# EAGLE schematic vm_mini_main3a (EAGLE 6.4)

## Sheet 1 of 4
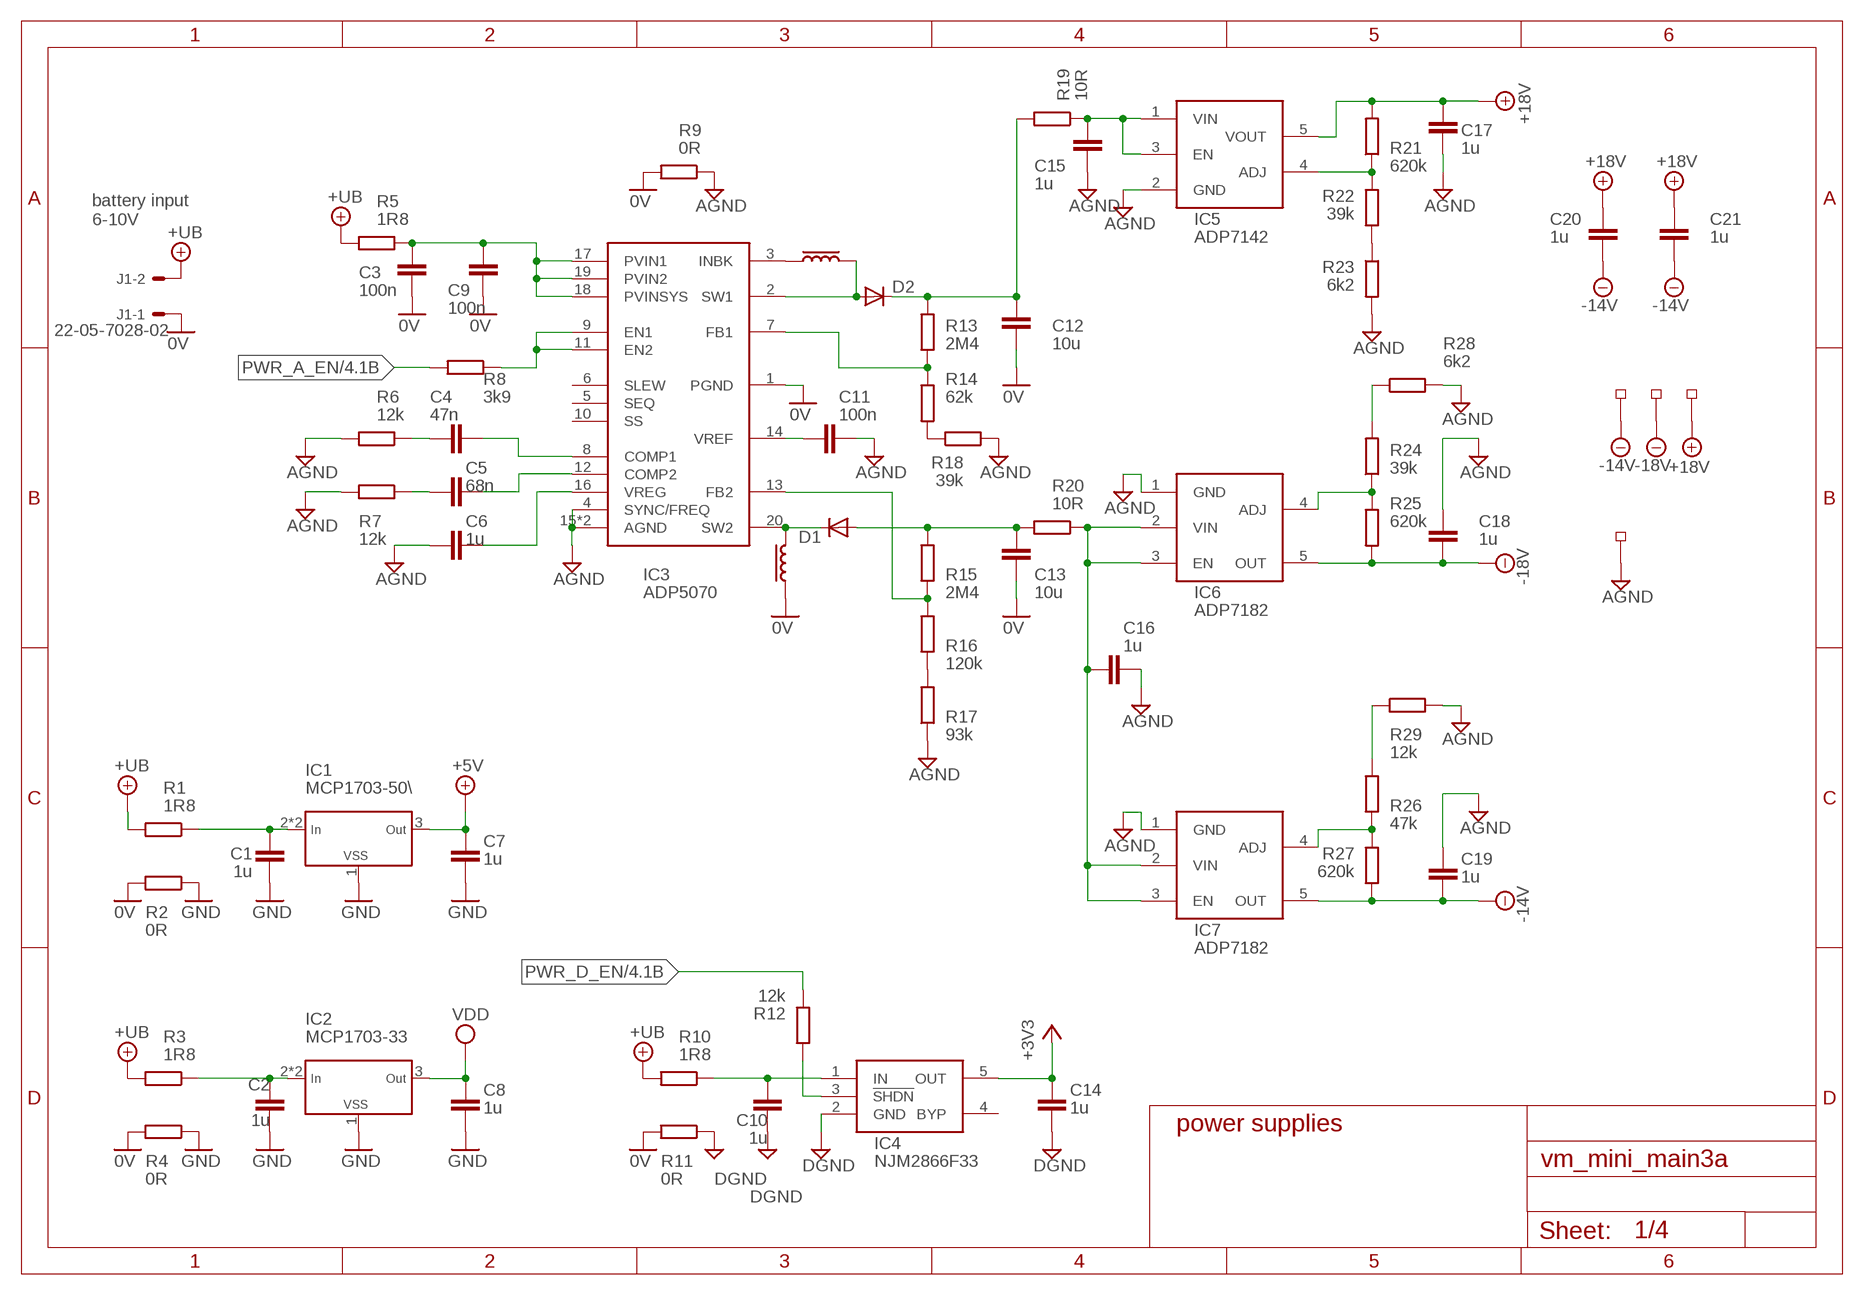
[diagram p0: schematic, sheet 1]

### Parts
C1  1u  C_0806  [R0805]
C2  1u  C_0806  [R0805]
C3  100n  C_0806  [R0805]
C4  47n  C_0806  [R0805]
C5  68n  C_0806  [R0805]
C6  1u  C_0806  [R0805]
C7  1u  C_0806  [R0805]
C8  1u  C_0806  [R0805]
C9  100n  C_0806  [R0805]
C10  1u  C_0806  [R0805]
C11  100n  C_0806  [R0805]
C12  10u  C_0806  [R0805]
C13  10u  C_0806  [R0805]
C14  1u  C_0806  [R0805]
C15  1u  C_0806  [R0805]
C16  1u  C_0806  [R0805]
C17  1u  C_0806  [R0805]
C18  1u  C_0806  [R0805]
C19  1u  C_0806  [R0805]
C20  1u  C_0806  [R0805]
C21  1u  C_0806  [R0805]
D1  DIODE-MINIMELF  [MINIMELF]
D2  DIODE-MINIMELF  [MINIMELF]
IC1  MCP1703-50\  MCP1702-SOT89  [SOT89]
IC2  MCP1703-33  MCP1702-SOT89  [SOT89]
IC3  ADP5070  [TSSOP20-EP]
IC4  NJM2866F33  TC1015  [SOT23-5]
IC5  ADP7142  [SOT23-5L]
IC6  ADP7182  [SOT23-5L]
IC7  ADP7182  [SOT23-5L]
J1  22-05-7028-02  [7395-02]
L1  INDUCTORBOURNS_SRP7030  [BOURNS_SRP7030]
L2  INDUCTORBOURNS_SRP7030  [BOURNS_SRP7030]
R1  1R8  RMMELF  [R_MINIMELF]
R2  0R  RMMELF  [R_MINIMELF]
R3  1R8  RMMELF  [R_MINIMELF]
R4  0R  RMMELF  [R_MINIMELF]
R5  1R8  RMMELF  [R_MINIMELF]
R6  12k  RMMELF  [R_MINIMELF]
R7  12k  RMMELF  [R_MINIMELF]
R8  3k9  RMMELF  [R_MINIMELF]
R9  0R  RMMELF  [R_MINIMELF]
R10  1R8  RMMELF  [R_MINIMELF]
R11  0R  RMMELF  [R_MINIMELF]
R12  12k  RMMELF  [R_MINIMELF]
R13  2M4  RMMELF  [R_MINIMELF]
R14  62k  RMMELF  [R_MINIMELF]
R15  2M4  RMMELF  [R_MINIMELF]
R16  120k  RMMELF  [R_MINIMELF]
R17  93k  RMMELF  [R_MINIMELF]
R18  39k  RMMELF  [R_MINIMELF]
R19  10R  RMMELF  [R_MINIMELF]
R20  10R  RMMELF  [R_MINIMELF]
R21  620k  RMMELF  [R_MINIMELF]
R22  39k  RMMELF  [R_MINIMELF]
R23  6k2  RMMELF  [R_MINIMELF]
R24  39k  RMMELF  [R_MINIMELF]
R25  620k  RMMELF  [R_MINIMELF]
R26  47k  RMMELF  [R_MINIMELF]
R27  620k  RMMELF  [R_MINIMELF]
R28  6k2  RMMELF  [R_MINIMELF]
R29  12k  RMMELF  [R_MINIMELF]
TP1  TEST_PADSMD_35X2  [TP_SMD_35X2]
TP2  TEST_PADSMD_35X2  [TP_SMD_35X2]
TP3  TEST_PADSMD_35X2  [TP_SMD_35X2]
TP4  TEST_PADSMD_35X2  [TP_SMD_35X2]

### Nets
0V: C3.2 C9.2 C12.2 C13.1 IC3.1(PGND) J1.1 L1.P$1 R2.P$2 R4.P$2 R9.P$2 R11.P$2
+3V3: C14.2 IC4.5(OUT) ; also sheet 2,3
+5V: C7.2 IC1.3(OUT) ; also sheet 4
+18V: C17.1 C20.1 C21.1 IC5.5(VOUT) R21.P$2 TP3.P$1 ; also sheet 2,4
+UB: J1.2 R1.P$2 R3.P$2 R5.P$2 R10.P$2 ; also sheet 4
-14V: C19.2 C20.2 C21.2 IC7.5(OUT) R27.P$2 TP1.P$1 ; also sheet 2,4
-18V: C18.2 IC6.5(OUT) R25.P$2 TP2.P$1 ; also sheet 2,4
AGND: C6.1 C11.1 C15.2 C16.2 C17.2 C18.1 C19.1 IC3.4(SYNC/FREQ) IC3.15(AGND) IC3.EP(AGND) IC5.2(GND) IC6.1(GND) IC7.1(GND) R6.P$2 R7.P$2 R9.P$1 R17.P$1 R18.P$2 R23.P$2 R28.P$2 R29.P$2 TP4.P$1 ; also sheet 2,4
DGND: C10.1 C14.1 IC4.2(GND) R11.P$1 ; also sheet 2,3
GND: C1.1 C2.1 C7.1 C8.1 IC1.1(VSS) IC2.1(VSS) R2.P$1 R4.P$1 ; also sheet 4
N$22: IC3.9(EN1) IC3.11(EN2) R8.P$1
N$23: IC4.3(!SHDN) R12.P$2
N$24: R24.P$2 R28.P$1
N$32: C16.1 IC6.2(VIN) IC6.3(EN) IC7.2(VIN) IC7.3(EN) R20.P$1
N$33: C15.1 IC5.1(VIN) IC5.3(EN) R19.P$1
N$48: IC3.3(INBK) L2.P$1
N$49: D1.C IC3.20(SW2) L1.P$2
N$50: D2.A IC3.2(SW1) L2.P$2
N$51: C3.1 C9.1 IC3.17(PVIN1) IC3.18(PVINSYS) IC3.19(PVIN2) R5.P$1
N$52: IC5.4(ADJ) R21.P$1 R22.P$1
N$53: C11.2 IC3.14(VREF)
N$57: C12.1 D2.C R13.P$1 R19.P$2
N$58: C4.1 R6.P$1
N$59: IC3.13(FB2) R15.P$1 R16.P$2
N$60: C5.1 R7.P$1
N$61: IC3.7(FB1) R13.P$2 R14.P$1
N$62: IC6.4(ADJ) R24.P$1 R25.P$1
N$68: C4.2 IC3.8(COMP1)
N$69: C5.2 IC3.12(COMP2)
N$70: C6.2 IC3.16(VREG)
N$71: C13.2 D1.A R15.P$2 R20.P$2
N$72: C10.2 IC4.1(IN) R10.P$1
N$74: C2.2 IC2.2(IN) IC2.2@1(IN) R3.P$1
N$77: C1.2 IC1.2(IN) IC1.2@1(IN) R1.P$1
N$78: IC7.4(ADJ) R26.P$1 R27.P$1
N$86: R22.P$2 R23.P$1
N$95: R26.P$2 R29.P$1
N$117: R16.P$1 R17.P$2
N$118: R14.P$2 R18.P$1
PWR_A_EN: R8.P$2 ; also sheet 4
PWR_D_EN: R12.P$1 ; also sheet 4
VDD: C8.2 IC2.3(OUT) ; also sheet 4
Unconnected: IC3.5(SEQ) IC3.6(SLEW) IC3.10(SS) IC4.4(BYP)

### Notes on the sheet
- battery input
  6-10V
- power supplies

## Sheet 2 of 4
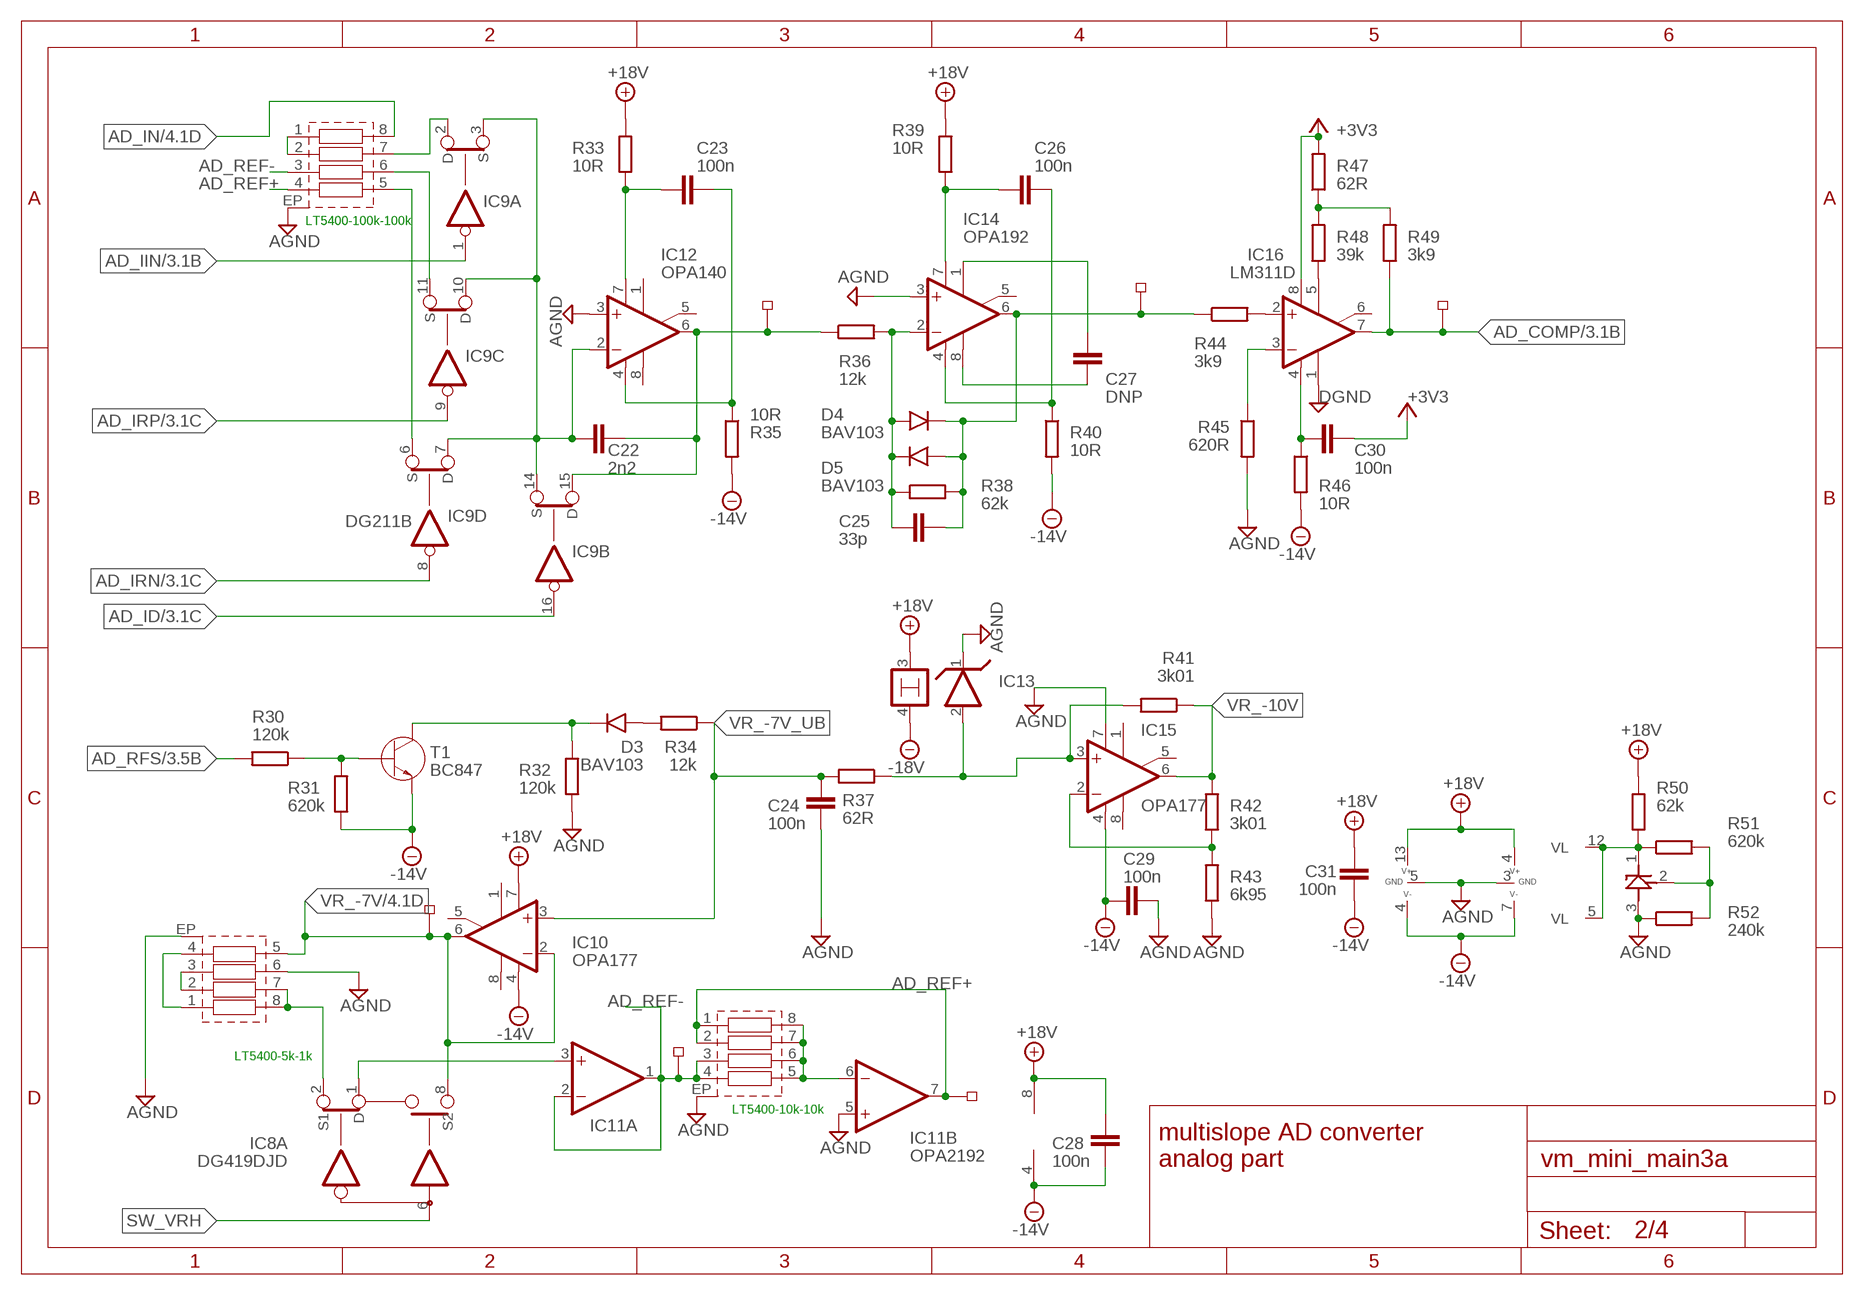
[diagram p1: schematic, sheet 2]

### Parts
C22  2n2  C-EU150-054X183  [C150-054X183]
C23  100n  C_0806  [R0805]
C24  100n  C-EU050-035X075  [C050-035X075]
C25  33p  CMM  [R_MINIMELF]
C26  100n  C_0806  [R0805]
C27  DNP  CMM  [R_MINIMELF]
C28  100n  C_0806  [R0805]
C29  100n  C_0806  [R0805]
C30  100n  C_0806  [R0805]
C31  100n  C_0806  [R0805]
D3  BAV103  1N4148SOD  [SOD-80]
D4  BAV103  1N4148SOD  [SOD-80]
D5  BAV103  1N4148SOD  [SOD-80]
IC8  DG419DJD  [SO08]
IC9  DG211B  DG211CJD  [SO16]
IC10  OPA177  TL071D  [SO08]
IC11  OPA2192  TL072D  [SO08]
IC12  OPA140  TL071D  [SO08]
IC13  LM399H  [TO39/4]
IC14  OPA192  TL071D  [SO08]
IC15  OPA177  TL071D  [SO08]
IC16  LM311D  [SO08]
IC17  TL431_SOT23  [SOT23]
R30  120k  RMMELF  [R_MINIMELF]
R31  620k  RMMELF  [R_MINIMELF]
R32  120k  RMMELF  [R_MINIMELF]
R33  10R  RMMELF  [R_MINIMELF]
R34  12k  RMMELF  [R_MINIMELF]
R35  10R  RMMELF  [R_MINIMELF]
R36  12k  RMMELF  [R_MINIMELF]
R37  62R  RMMELF  [R_MINIMELF]
R38  62k  RMMELF  [R_MINIMELF]
R39  10R  RMMELF  [R_MINIMELF]
R40  10R  RMMELF  [R_MINIMELF]
R41  3k01  R191  [R_TR191]
R42  3k01  R191  [R_TR191]
R43  6k95  R191  [R_TR191]
R44  3k9  RMMELF  [R_MINIMELF]
R45  620R  RMMELF  [R_MINIMELF]
R46  10R  RMMELF  [R_MINIMELF]
R47  62R  RMMELF  [R_MINIMELF]
R48  39k  RMMELF  [R_MINIMELF]
R49  3k9  RMMELF  [R_MINIMELF]
R50  62k  RMMELF  [R_MINIMELF]
R51  620k  RMMELF  [R_MINIMELF]
R52  240k  RMMELF  [R_MINIMELF]
RN1  LT5400-5k-1k  LT5400  [MSOP8-EP]
RN2  LT5400-100k-100k  LT5400  [MSOP8-EP]
RN3  LT5400-10k+10k  LT5400  [MSOP8-EP]
T1  BC847  [SOT23]
TP5  TEST_PADSMD_35X2  [TP_SMD_35X2]
TP6  TEST_PADSMD_35X2  [TP_SMD_35X2]
TP7  TEST_PADSMD_35X2  [TP_SMD_35X2]
TP8  TEST_PADSMD_35X2  [TP_SMD_35X2]
TP9  TEST_PADSMD_35X2  [TP_SMD_35X2]
TP21  TEST_PADSMD_35X2  [TP_SMD_35X2]

### Nets
+3V3: C30.1 IC16.8(V+) R47.P$2 ; also sheet 1,3
+18V: C28.2 C31.2 IC8.4(P:V+) IC9.13(P:V+) IC10.7(V+) IC11.8(P:V+) IC13.3 R33.P$2 R39.P$2 R50.P$1 ; also sheet 1,4
-14V: C28.1 C29.1 C31.1 IC8.7(P:V-) IC9.4(P:V-) IC10.4(V-) IC11.4(P:V-) IC15.4(V-) R31.P$1 R35.P$2 R40.P$2 R46.P$2 T1.2(E) ; also sheet 1,4
-18V: IC13.4 ; also sheet 1,4
AD_COMP: IC16.7(OUT) R49.P$1 TP7.P$1 ; also sheet 3
AD_ID: IC9.16(B:IN) ; also sheet 3
AD_IIN: IC9.1(A:IN) ; also sheet 3
AD_IN: RN2.8(R1B) ; also sheet 4
AD_IRN: IC9.8(D:IN) ; also sheet 3
AD_IRP: IC9.9(C:IN) ; also sheet 3
AD_REF+: IC11.7(B:OUT) RN2.4(R4A) RN3.1(R1A) RN3.2(R2A) TP8.P$1
AD_REF-: IC11.1(A:OUT) IC11.2(A:-IN) RN2.3(R3A) RN3.3(R3A) RN3.4(R4A) TP9.P$1
AD_RFS: R30.P$2 ; also sheet 3
AGND: C24.2 C29.2 IC8.3(P:GND) IC9.5(P:GND) IC11.5(B:+IN) IC12.3(+IN) IC13.1 IC14.3(+IN) IC15.7(V+) IC17.3(A) R32.P$2 R43.P$1 R45.P$2 R52.P$1 RN1.6(R3B) RN1.EP(SH) RN2.EP(SH) RN3.EP(SH) ; also sheet 1,4
DGND: IC16.1(GND) ; also sheet 1,3
N$15: C22.1 IC9.3(A:S) IC9.7(D:D) IC9.10(C:D) IC9.14(B:S) IC12.2(-IN)
N$17: IC15.2(-IN) R42.P$2 R43.P$2
N$18: IC9.2(A:D) RN2.7(R2B)
N$19: C22.2 IC9.15(B:D) IC12.6(OUT) R36.P$1 TP5.P$1
N$25: IC9.11(C:S) RN2.6(R3B)
N$26: IC9.6(D:S) RN2.5(R4B)
N$27: C23.2 IC12.7(V+) R33.P$1
N$28: C23.1 IC12.4(V-) R35.P$1
N$29: IC8.1(A:D) IC11.3(A:+IN)
N$30: RN1.1(R1A) RN1.4(R4A)
N$38: D3.A R34.P$2
N$45: IC8.2(A:S1) RN1.7(R2B) RN1.8(R1B)
N$54: IC13.2 IC15.3(+IN) R37.P$1 R41.P$2
N$56: C25.P$1 D4.A D5.K IC14.2(-IN) R36.P$2 R38.P$1
N$63: R30.P$1 R31.P$2 T1.1(B)
N$64: D3.K R32.P$1 T1.3(C)
N$65: RN2.1(R1A) RN2.2(R2A)
N$66: IC11.6(B:-IN) RN3.5(R4B) RN3.6(R3B) RN3.7(R2B) RN3.8(R1B)
N$67: RN1.2(R2A) RN1.3(R3A)
N$79: C26.2 IC14.7(V+) R39.P$1
N$80: C26.1 IC14.4(V-) R40.P$1
N$81: C25.P$2 D4.K D5.A IC14.6(OUT) R38.P$2 R44.P$1 TP6.P$1
N$84: IC16.5(ON) R48.P$1
N$85: R47.P$1 R48.P$2 R49.P$2
N$87: C30.2 IC16.4(V-) R46.P$1
N$88: IC16.2(+IN) R44.P$2
N$89: IC16.3(-IN) R45.P$1
N$90: IC17.2(R) R51.P$2 R52.P$2
N$91: IC8.5(VL:VL) IC9.12(VL:VL) IC17.1(C) R50.P$2 R51.P$1
N$115: C27.P$1 IC14.8(OPT)
N$116: C27.P$2 IC14.1(ON1)
SW_VRH: IC8.6(A:IN)
VR_-7V: IC8.8(A:S2) IC10.2(-IN) IC10.6(OUT) RN1.5(R4B) TP21.P$1 ; also sheet 4
VR_-7V_UB: C24.1 IC10.3(+IN) R34.P$1 R37.P$2
VR_-10V: IC15.6(OUT) R41.P$1 R42.P$1
Unconnected: IC10.1(ON1) IC10.5(ON2) IC10.8(OPT) IC12.1(ON1) IC12.5(ON2) IC12.8(OPT) IC14.5(ON2) IC15.1(ON1) IC15.5(ON2) IC15.8(OPT) IC16.6(ON/STR)

### Notes on the sheet
- LT5400-100k-100k
- LT5400-5k-1k
- LT5400-10k-10k
- multislope AD converter
  analog part

## Sheet 3 of 4
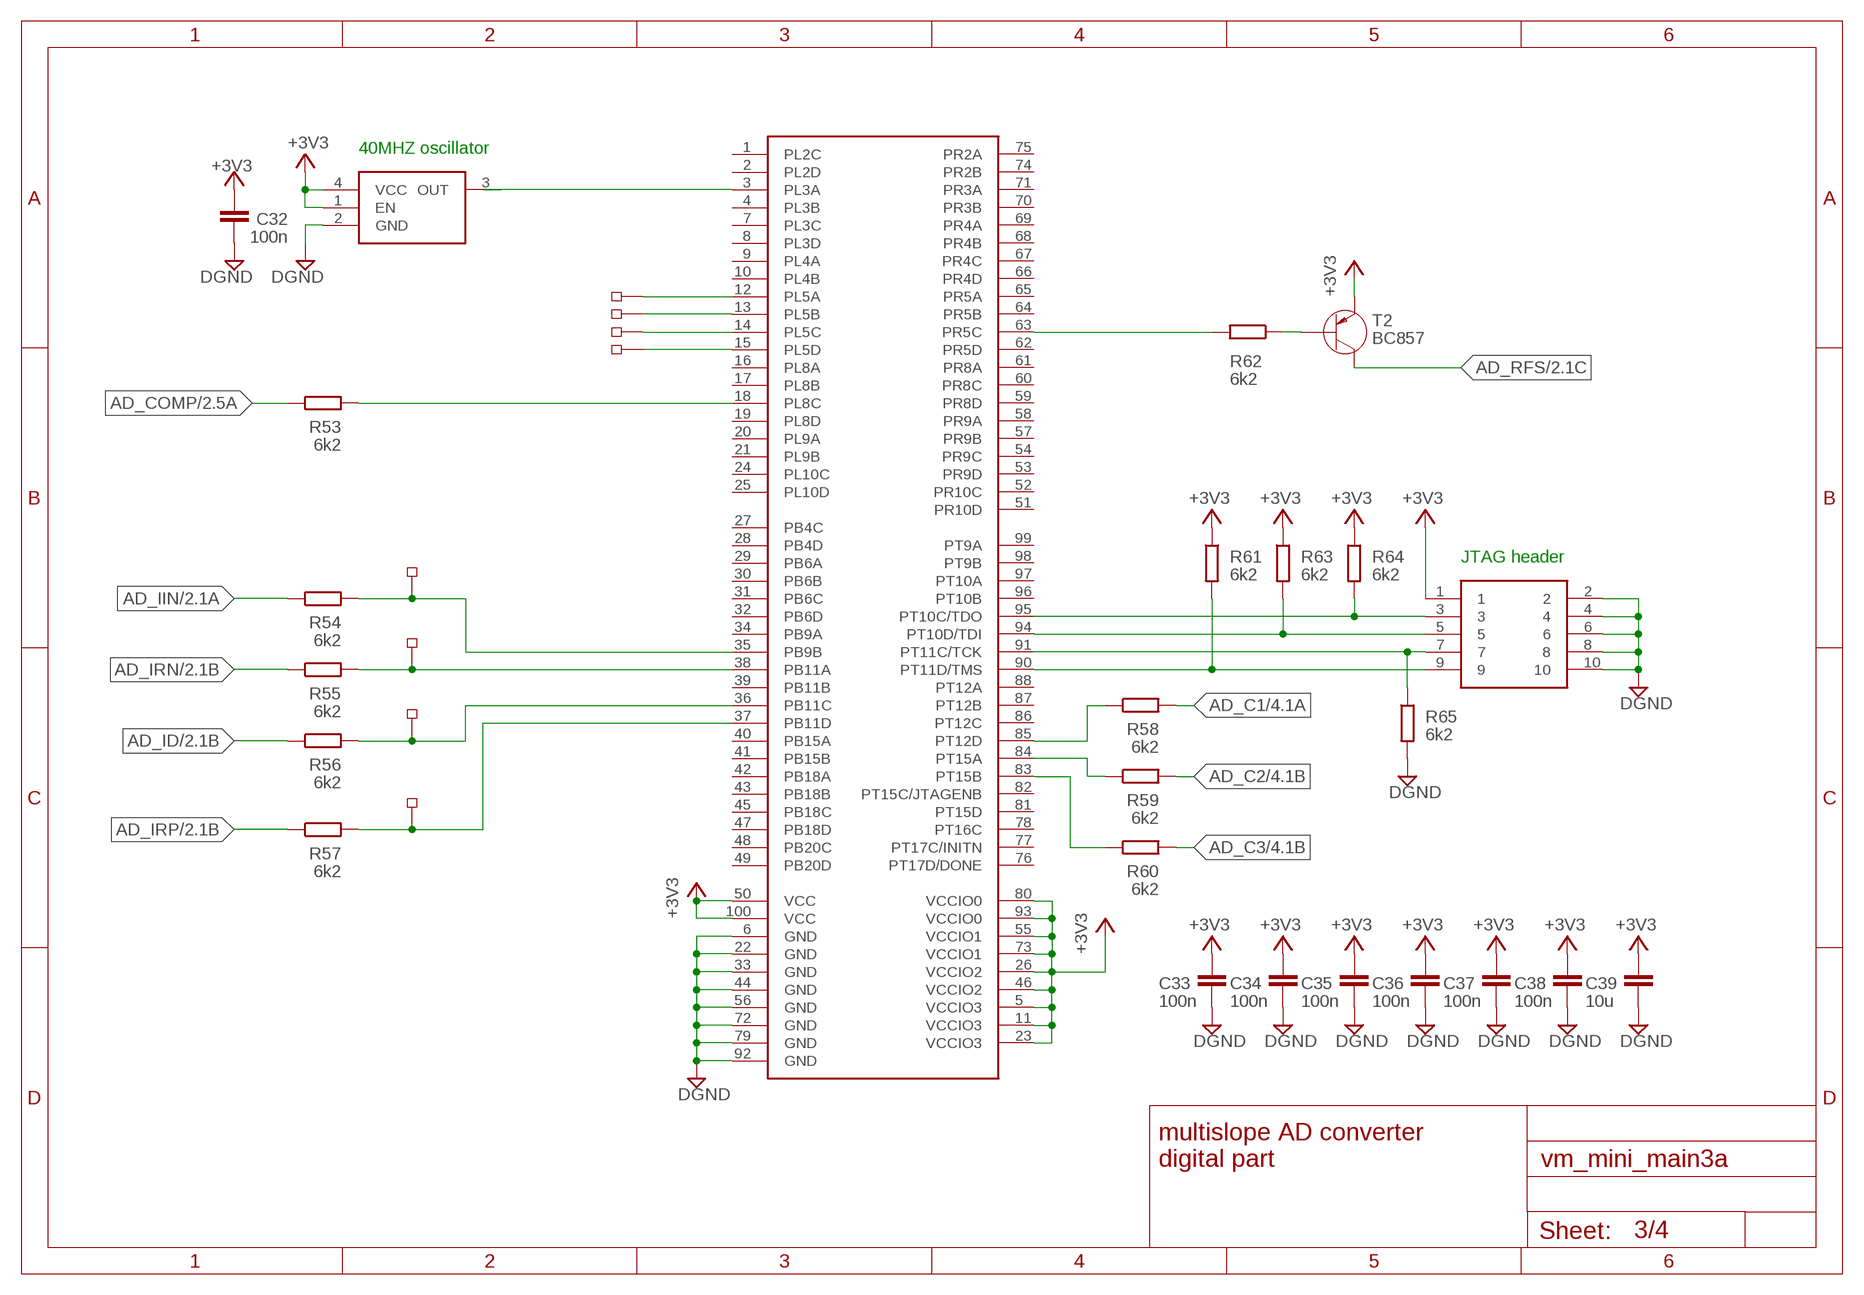
[diagram p2: schematic, sheet 3]

### Parts
C32  100n  C_0806  [R0805]
C33  100n  C_0806  [R0805]
C34  100n  C_0806  [R0805]
C35  100n  C_0806  [R0805]
C36  100n  C_0806  [R0805]
C37  100n  C_0806  [R0805]
C38  100n  C_0806  [R0805]
C39  10u  C_0806  [R0805]
CON1  IDC_10_2MM  [IDC_20_10P]
IC18  MACHXO2-1200-TQ100T100  [TQFP100]
OSC1  OSC3225  [OSC_3225]
R53  6k2  RMMELF  [R_MINIMELF]
R54  6k2  RMMELF  [R_MINIMELF]
R55  6k2  RMMELF  [R_MINIMELF]
R56  6k2  RMMELF  [R_MINIMELF]
R57  6k2  RMMELF  [R_MINIMELF]
R58  6k2  RMMELF  [R_MINIMELF]
R59  6k2  RMMELF  [R_MINIMELF]
R60  6k2  RMMELF  [R_MINIMELF]
R61  6k2  RMMELF  [R_MINIMELF]
R62  6k2  RMMELF  [R_MINIMELF]
R63  6k2  RMMELF  [R_MINIMELF]
R64  6k2  RMMELF  [R_MINIMELF]
R65  6k2  RMMELF  [R_MINIMELF]
T2  BC857  [SOT23]
TP10  TEST_PADSMD_35X2  [TP_SMD_35X2]
TP11  TEST_PADSMD_35X2  [TP_SMD_35X2]
TP12  TEST_PADSMD_35X2  [TP_SMD_35X2]
TP13  TEST_PADSMD_35X2  [TP_SMD_35X2]
TP14  TEST_PADSMD_35X2  [TP_SMD_35X2]
TP15  TEST_PADSMD_35X2  [TP_SMD_35X2]
TP16  TEST_PADSMD_35X2  [TP_SMD_35X2]
TP17  TEST_PADSMD_35X2  [TP_SMD_35X2]

### Nets
+3V3: C32.2 C33.2 C34.2 C35.2 C36.2 C37.2 C38.2 C39.2 CON1.1 IC18.5(VCCIO3) IC18.11(VCCIO3) IC18.23(VCCIO3) IC18.26(VCCIO2) IC18.46(VCCIO2) IC18.50(VCC) IC18.55(VCCIO1) IC18.73(VCCIO1) IC18.80(VCCIO0) IC18.93(VCCIO0) IC18.100(VCC) OSC1.1(EN) OSC1.4(VCC) R61.P$1 R63.P$1 R64.P$1 T2.2(C) ; also sheet 1,2
AD_C1: R58.P$2 ; also sheet 4
AD_C2: R59.P$2 ; also sheet 4
AD_C3: R60.P$2 ; also sheet 4
AD_COMP: R53.P$1 ; also sheet 2
AD_ID: R56.P$1 ; also sheet 2
AD_IIN: R54.P$1 ; also sheet 2
AD_IRN: R55.P$1 ; also sheet 2
AD_IRP: R57.P$1 ; also sheet 2
AD_RFS: T2.3(E) ; also sheet 2
DGND: C32.1 C33.1 C34.1 C35.1 C36.1 C37.1 C38.1 C39.1 CON1.2 CON1.4 CON1.6 CON1.8 CON1.10 IC18.6(GND) IC18.22(GND) IC18.33(GND) IC18.44(GND) IC18.56(GND) IC18.72(GND) IC18.79(GND) IC18.92(GND) OSC1.2(GND) R65.P$2 ; also sheet 1,2
N$16: IC18.3(PL3A) OSC1.3(OUT)
N$37: R62.P$1 T2.1(B)
N$42: IC18.35(PB9B) R54.P$2 TP10.P$1
N$43: CON1.9 IC18.90(PT11D/TMS) R61.P$2
N$44: CON1.7 IC18.91(PT11C/TCK) R65.P$1
N$46: CON1.5 IC18.94(PT10D/TDI) R63.P$2
N$47: CON1.3 IC18.95(PT10C/TDO) R64.P$2
N$55: IC18.84(PT15A) R59.P$1
N$73: IC18.36(PB11C) R56.P$2 TP13.P$1
N$75: IC18.83(PT15B) R60.P$1
N$76: IC18.37(PB11D) R57.P$2 TP11.P$1
N$82: IC18.38(PB11A) R55.P$2 TP12.P$1
N$83: IC18.18(PL8C) R53.P$2
N$92: IC18.63(PR5C) R62.P$2
N$96: IC18.85(PT12D) R58.P$1
N$103: IC18.12(PL5A) TP14.P$1
N$104: IC18.13(PL5B) TP15.P$1
N$105: IC18.14(PL5C) TP16.P$1
N$106: IC18.15(PL5D) TP17.P$1
Unconnected: IC18.1(PL2C) IC18.2(PL2D) IC18.4(PL3B) IC18.7(PL3C) IC18.8(PL3D) IC18.9(PL4A) IC18.10(PL4B) IC18.16(PL8A) IC18.17(PL8B) IC18.19(PL8D) IC18.20(PL9A) IC18.21(PL9B) IC18.24(PL10C) IC18.25(PL10D) IC18.27(PB4C) IC18.28(PB4D) IC18.29(PB6A) IC18.30(PB6B) IC18.31(PB6C) IC18.32(PB6D) IC18.34(PB9A) IC18.39(PB11B) IC18.40(PB15A) IC18.41(PB15B) IC18.42(PB18A) IC18.43(PB18B) IC18.45(PB18C) IC18.47(PB18D) IC18.48(PB20C) IC18.49(PB20D) IC18.51(PR10D) IC18.52(PR10C) IC18.53(PR9D) IC18.54(PR9C) IC18.57(PR9B) IC18.58(PR9A) IC18.59(PR8D) IC18.60(PR8C) IC18.61(PR8A) IC18.62(PR5D) IC18.64(PR5B) IC18.65(PR5A) IC18.66(PR4D) IC18.67(PR4C) IC18.68(PR4B) IC18.69(PR4A) IC18.70(PR3B) IC18.71(PR3A) IC18.74(PR2B) IC18.75(PR2A) IC18.76(PT17D/DONE) IC18.77(PT17C/INITN) IC18.78(PT16C) IC18.81(PT15D) IC18.82(PT15C/JTAGENB) IC18.86(PT12C) IC18.87(PT12B) IC18.88(PT12A) IC18.96(PT10B) IC18.97(PT10A) IC18.98(PT9B) IC18.99(PT9A)

### Notes on the sheet
- 40MHZ oscillator
- JTAG header
- multislope AD converter
  digital part

## Sheet 4 of 4
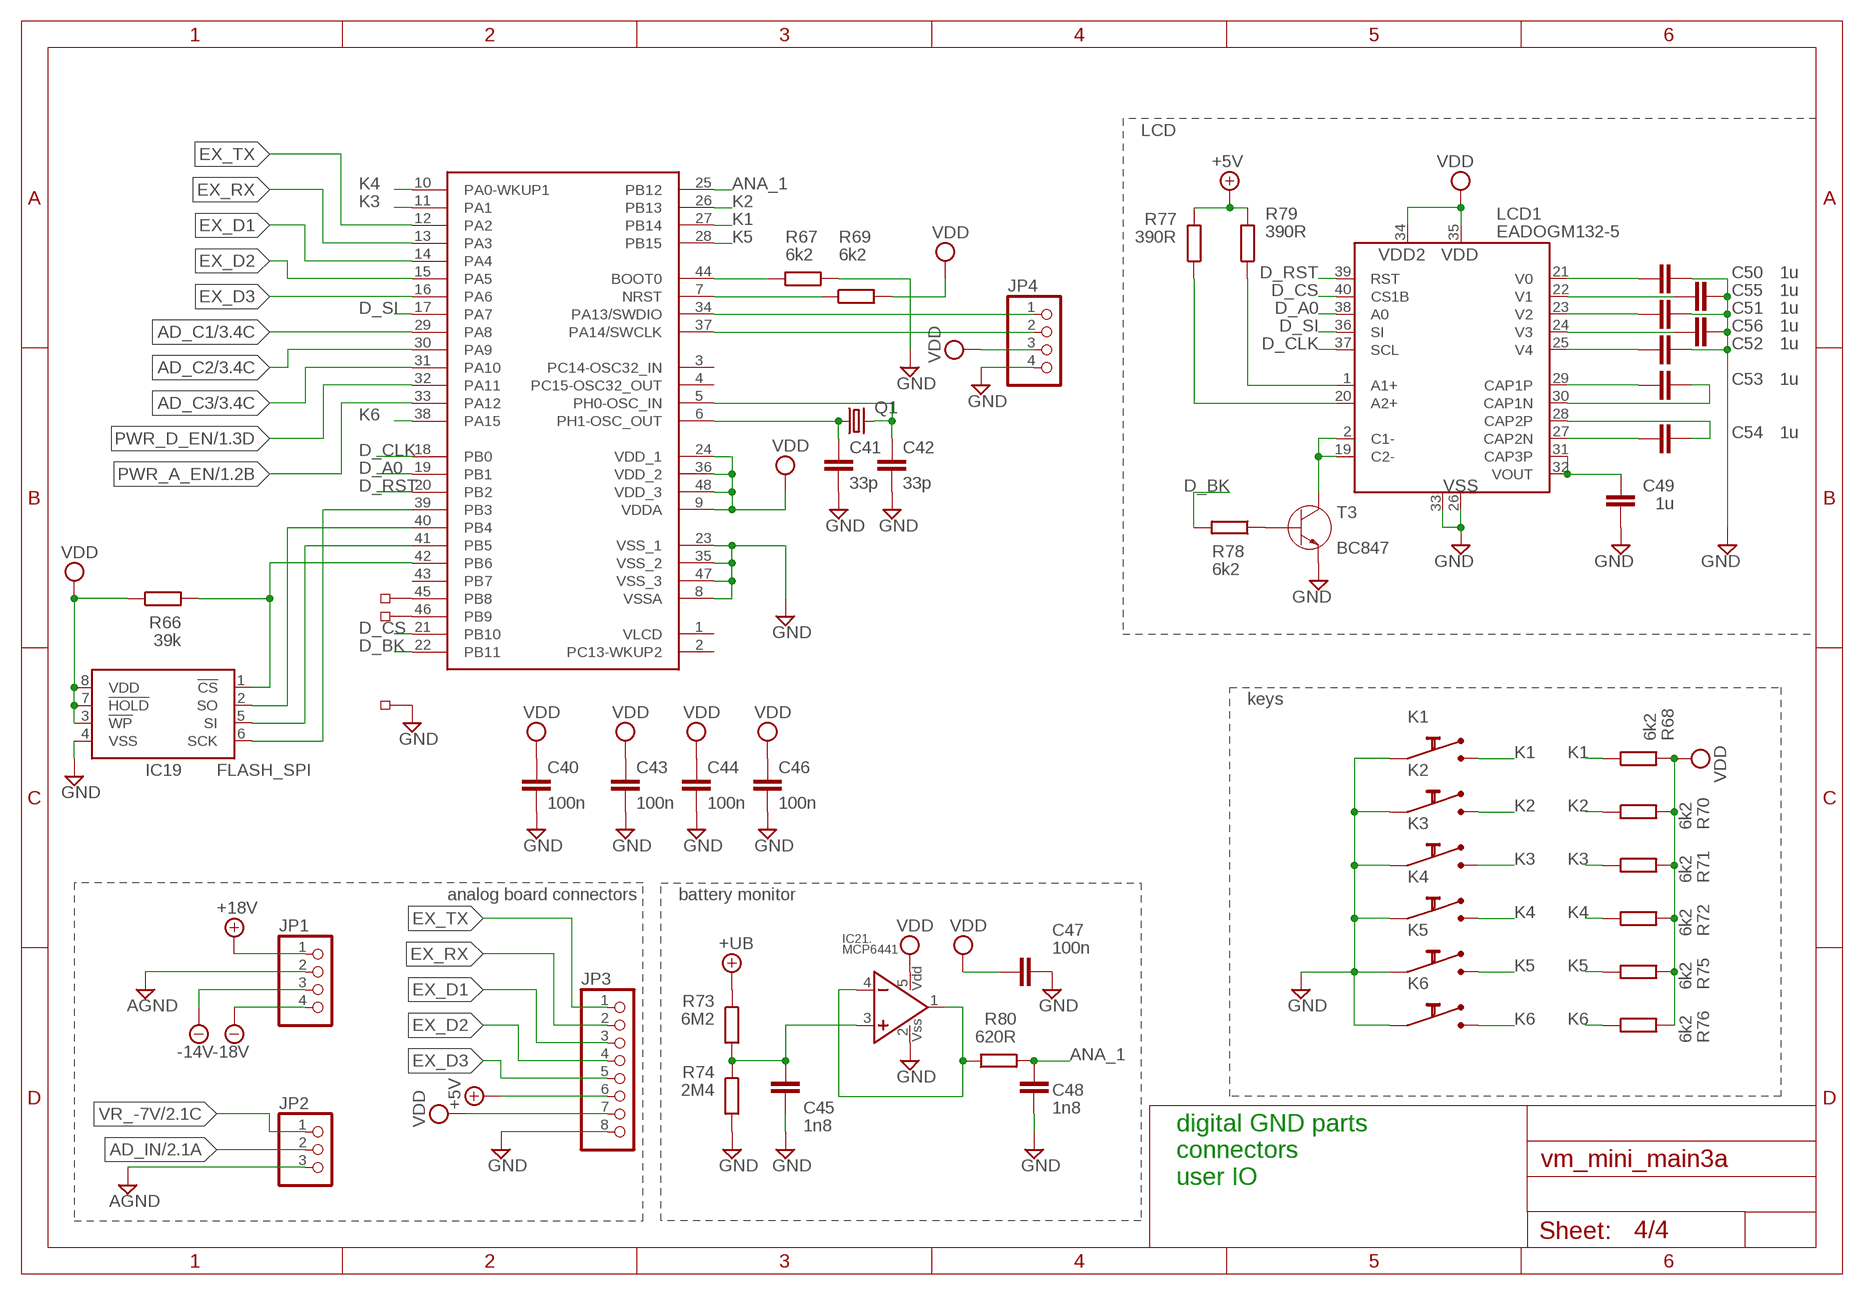
[diagram p3: schematic, sheet 4]

### Parts
C40  100n  C_0806  [R0805]
C41  33p  C_0806  [R0805]
C42  33p  C_0806  [R0805]
C43  100n  C_0806  [R0805]
C44  100n  C_0806  [R0805]
C45  1n8  CMM  [R_MINIMELF]
C46  100n  C_0806  [R0805]
C47  100n  C_0806  [R0805]
C48  1n8  CMM  [R_MINIMELF]
C49  1u  C_0806  [R0805]
C50  1u  C_0806  [R0805]
C51  1u  C_0806  [R0805]
C52  1u  C_0806  [R0805]
C53  1u  C_0806  [R0805]
C54  1u  C_0806  [R0805]
C55  1u  C_0806  [R0805]
C56  1u  C_0806  [R0805]
IC19  FLASH_SPI  EEPROM_SPI-SOIC  [SO-08]
IC20  STM32L152XC_LQFP48  [LQFP48]
IC21  MCP6441  MCP6021  [SOT23-5L]
JP1  PINHD-1X04_2.54  [1X04]
JP2  PINHD-1X03_2.54  [1X03]
JP3  PINHD-1X08_2.54  [1X08]
JP4  PINHD-1X04_2.54-90°  [1X04/90]
K1  SWITCH_MINI6450  [SWITCH_6450]
K2  SWITCH_MINI6450  [SWITCH_6450]
K3  SWITCH_MINI6450  [SWITCH_6450]
K4  SWITCH_MINI6450  [SWITCH_6450]
K5  SWITCH_MINI6450  [SWITCH_6450]
K6  SWITCH_MINI6450  [SWITCH_6450]
LCD1  EADOGM132-5  [EADOGM]
Q1  CRYSTALHC49UP  [HC49UP]
R66  39k  RMMELF  [R_MINIMELF]
R67  6k2  RMMELF  [R_MINIMELF]
R68  6k2  RMMELF  [R_MINIMELF]
R69  6k2  RMMELF  [R_MINIMELF]
R70  6k2  RMMELF  [R_MINIMELF]
R71  6k2  RMMELF  [R_MINIMELF]
R72  6k2  RMMELF  [R_MINIMELF]
R73  6M2  RMMELF  [R_MINIMELF]
R74  2M4  RMMELF  [R_MINIMELF]
R75  6k2  RMMELF  [R_MINIMELF]
R76  6k2  RMMELF  [R_MINIMELF]
R77  390R  RMMELF  [R_MINIMELF]
R78  6k2  RMMELF  [R_MINIMELF]
R79  390R  RMMELF  [R_MINIMELF]
R80  620R  RMMELF  [R_MINIMELF]
T3  BC847  [SOT23]
TP18  TEST_PADSMD_35X2  [TP_SMD_35X2]
TP19  TEST_PADSMD_35X2  [TP_SMD_35X2]
TP20  TEST_PADSMD_35X2  [TP_SMD_35X2]

### Nets
+5V: JP3.6 R77.P$2 R79.P$2 ; also sheet 1
+18V: JP1.1 ; also sheet 1,2
+UB: R73.P$1 ; also sheet 1
-14V: JP1.3 ; also sheet 1,2
-18V: JP1.4 ; also sheet 1,2
AD_C1: IC20.29(PA8) ; also sheet 3
AD_C2: IC20.30(PA9) ; also sheet 3
AD_C3: IC20.31(PA10) ; also sheet 3
AD_IN: JP2.2 ; also sheet 2
AGND: JP1.2 JP2.3 ; also sheet 1,2
ANA_1: C48.P$1 IC20.25(PB12) R80.P$2
D_A0: IC20.19(PB1) LCD1.38(A0)
D_BK: IC20.22(PB11) R78.P$2
D_CLK: IC20.18(PB0) LCD1.37(SCL)
D_CS: IC20.21(PB10) LCD1.40(CS1B)
D_RST: IC20.20(PB2) LCD1.39(RST)
D_SI: IC20.17(PA7) LCD1.36(SI)
EX_D1: IC20.14(PA4) JP3.3
EX_D2: IC20.15(PA5) JP3.4
EX_D3: IC20.16(PA6) JP3.5
EX_RX: IC20.13(PA3) JP3.2
EX_TX: IC20.12(PA2) JP3.1
GND: C40.2 C41.2 C42.2 C43.2 C44.2 C45.P$2 C46.2 C47.2 C48.P$2 C49.2 C50.2 C51.2 C52.2 C55.2 C56.2 IC19.4(VSS) IC20.8(VSSA) IC20.23(VSS_1) IC20.35(VSS_2) IC20.47(VSS_3) IC21.2(VSS) JP3.8 JP4.4 K1.P$1 K2.P$1 K3.P$1 K4.P$1 K5.P$1 K6.P$1 LCD1.26(VSS) LCD1.33(VSS1) R67.P$2 R74.P$2 T3.2(E) TP20.P$1 ; also sheet 1
K1: IC20.27(PB14) K1.P$2 R68.P$1
K2: IC20.26(PB13) K2.P$2 R70.P$1
K3: IC20.11(PA1) K3.P$2 R71.P$1
K4: IC20.10(PA0-WKUP1) K4.P$2 R72.P$1
K5: IC20.28(PB15) K5.P$2 R75.P$1
K6: IC20.38(PA15) K6.P$2 R76.P$1
N$10: LCD1.1(A1+) R79.P$1
N$11: LCD1.20(A2+) R77.P$1
N$12: LCD1.2(C1-) LCD1.19(C2-) T3.3(C)
N$13: R78.P$1 T3.1(B)
N$14: C50.1 LCD1.21(V0)
N$20: C55.1 LCD1.22(V1)
N$21: C51.1 LCD1.23(V2)
N$31: C56.1 LCD1.24(V3)
N$34: C52.1 LCD1.25(V4)
N$35: C53.1 LCD1.29(CAP1P)
N$36: C53.2 LCD1.30(CAP1N)
N$39: C54.2 LCD1.28(CAP2P)
N$40: C54.1 LCD1.27(CAP2N)
N$41: C49.1 LCD1.31(CAP3P) LCD1.32(VOUT)
N$97: IC20.34(PA13/SWDIO) JP4.1
N$98: IC20.37(PA14/SWCLK) JP4.2
N$99: C41.1 IC20.6(PH1-OSC_OUT) Q1.1
N$100: C42.1 IC20.5(PH0-OSC_IN) Q1.2
N$101: IC20.44(BOOT0) R67.P$1
N$102: IC20.7(NRST) R69.P$1
N$107: C45.P$1 IC21.3(.:NEIN+) R73.P$2 R74.P$1
N$108: IC19.6(SCK) IC20.39(PB3)
N$109: IC21.1(.:VYSTUP) IC21.4(.:IN-) R80.P$1
N$110: IC19.2(SO) IC20.40(PB4)
N$111: IC19.5(SI) IC20.41(PB5)
N$112: IC19.1(!CS) IC20.42(PB6) R66.P$2
N$113: IC20.45(PB8) TP18.P$1
N$114: IC20.46(PB9) TP19.P$1
PWR_A_EN: IC20.33(PA12) ; also sheet 1
PWR_D_EN: IC20.32(PA11) ; also sheet 1
VDD: C40.1 C43.1 C44.1 C46.1 C47.1 IC19.3(!WP) IC19.7(!HOLD) IC19.8(VDD) IC20.9(VDDA) IC20.24(VDD_1) IC20.36(VDD_2) IC20.48(VDD_3) IC21.5(VDD) JP3.7 JP4.3 LCD1.34(VDD2) LCD1.35(VDD) R66.P$1 R68.P$2 R69.P$2 R70.P$2 R71.P$2 R72.P$2 R75.P$2 R76.P$2 ; also sheet 1
VR_-7V: JP2.1 ; also sheet 2
Unconnected: IC20.1(VLCD) IC20.2(PC13-WKUP2) IC20.3(PC14-OSC32_IN) IC20.4(PC15-OSC32_OUT) IC20.43(PB7)

### Notes on the sheet
- LCD
- keys
- analog board connectors | battery monitor
- digital GND parts
  connectors
  user IO

## Library data of the parts
C1-C21 C23 C25-C56 = _moja:C
C22 C24 = _rcl:C-EU: CAPACITOR, European symbol
CON1 = _mcs1a:IDC_10
D1 D2 = diode:DIODE-: DIODE
D3-D5 = _mcom6:1N4148
IC1 IC2 = _mcom6:MCP1702
IC3 = _mcom6:ADP5070
IC4 = _moja:TC1015
IC5 = _mcom6:ADP7142
IC6 IC7 = _mcom6:ADP7182
IC8 = linear:DG419DJ: CMOS SWITCH
IC9 = linear:DG211CJ: CMOS SWITCH
IC10 IC12 IC14 IC15 = linear:TL071: OP AMP
IC11 = linear:TL072: OP AMP
IC13 = _linear:LM399H: Precision Z DIODE
IC16 = _linear:LM311: COMPARATOR
IC17 = _mcom6:TL431
IC18 = _jl4:MACHXO2-1200-TQ100
IC19 = _mcom6:EEPROM_SPI
IC20 = _jl4:STM32L152XC_LQFP48
IC21 = _mcom6:MCP6021
J1 = con-molex:22-?-02: CONNECTOR wire to board 2.54 mm (.1 inch) pitch header; OC_FARNELL: 9731601; OC_NEWARK: unknown
JP1 JP4 = pinhead-2:PINHD-1X04: PIN HEADER
JP2 = pinhead-2:PINHD-1X03: PIN HEADER
JP3 = pinhead-2:PINHD-1X08: PIN HEADER
K1-K6 = _moja:SWITCH_MINI
L1 L2 = _mcs1:INDUCTOR
LCD1 = _mcom6:EADOGM132
OSC1 = _mcs1a:OSC
Q1 = crystal:CRYSTAL: CRYSTAL
R1-R80 = _moja:R
RN1-RN3 = _mcom6:LT5400
T1 T3 = _mcom6:BC847
T2 = _mcom6:BC857
TP1-TP21 = _moja_e:TEST_PAD